# EAGLE design Piksey_Pico_A1 (EAGLE 9.0.1)
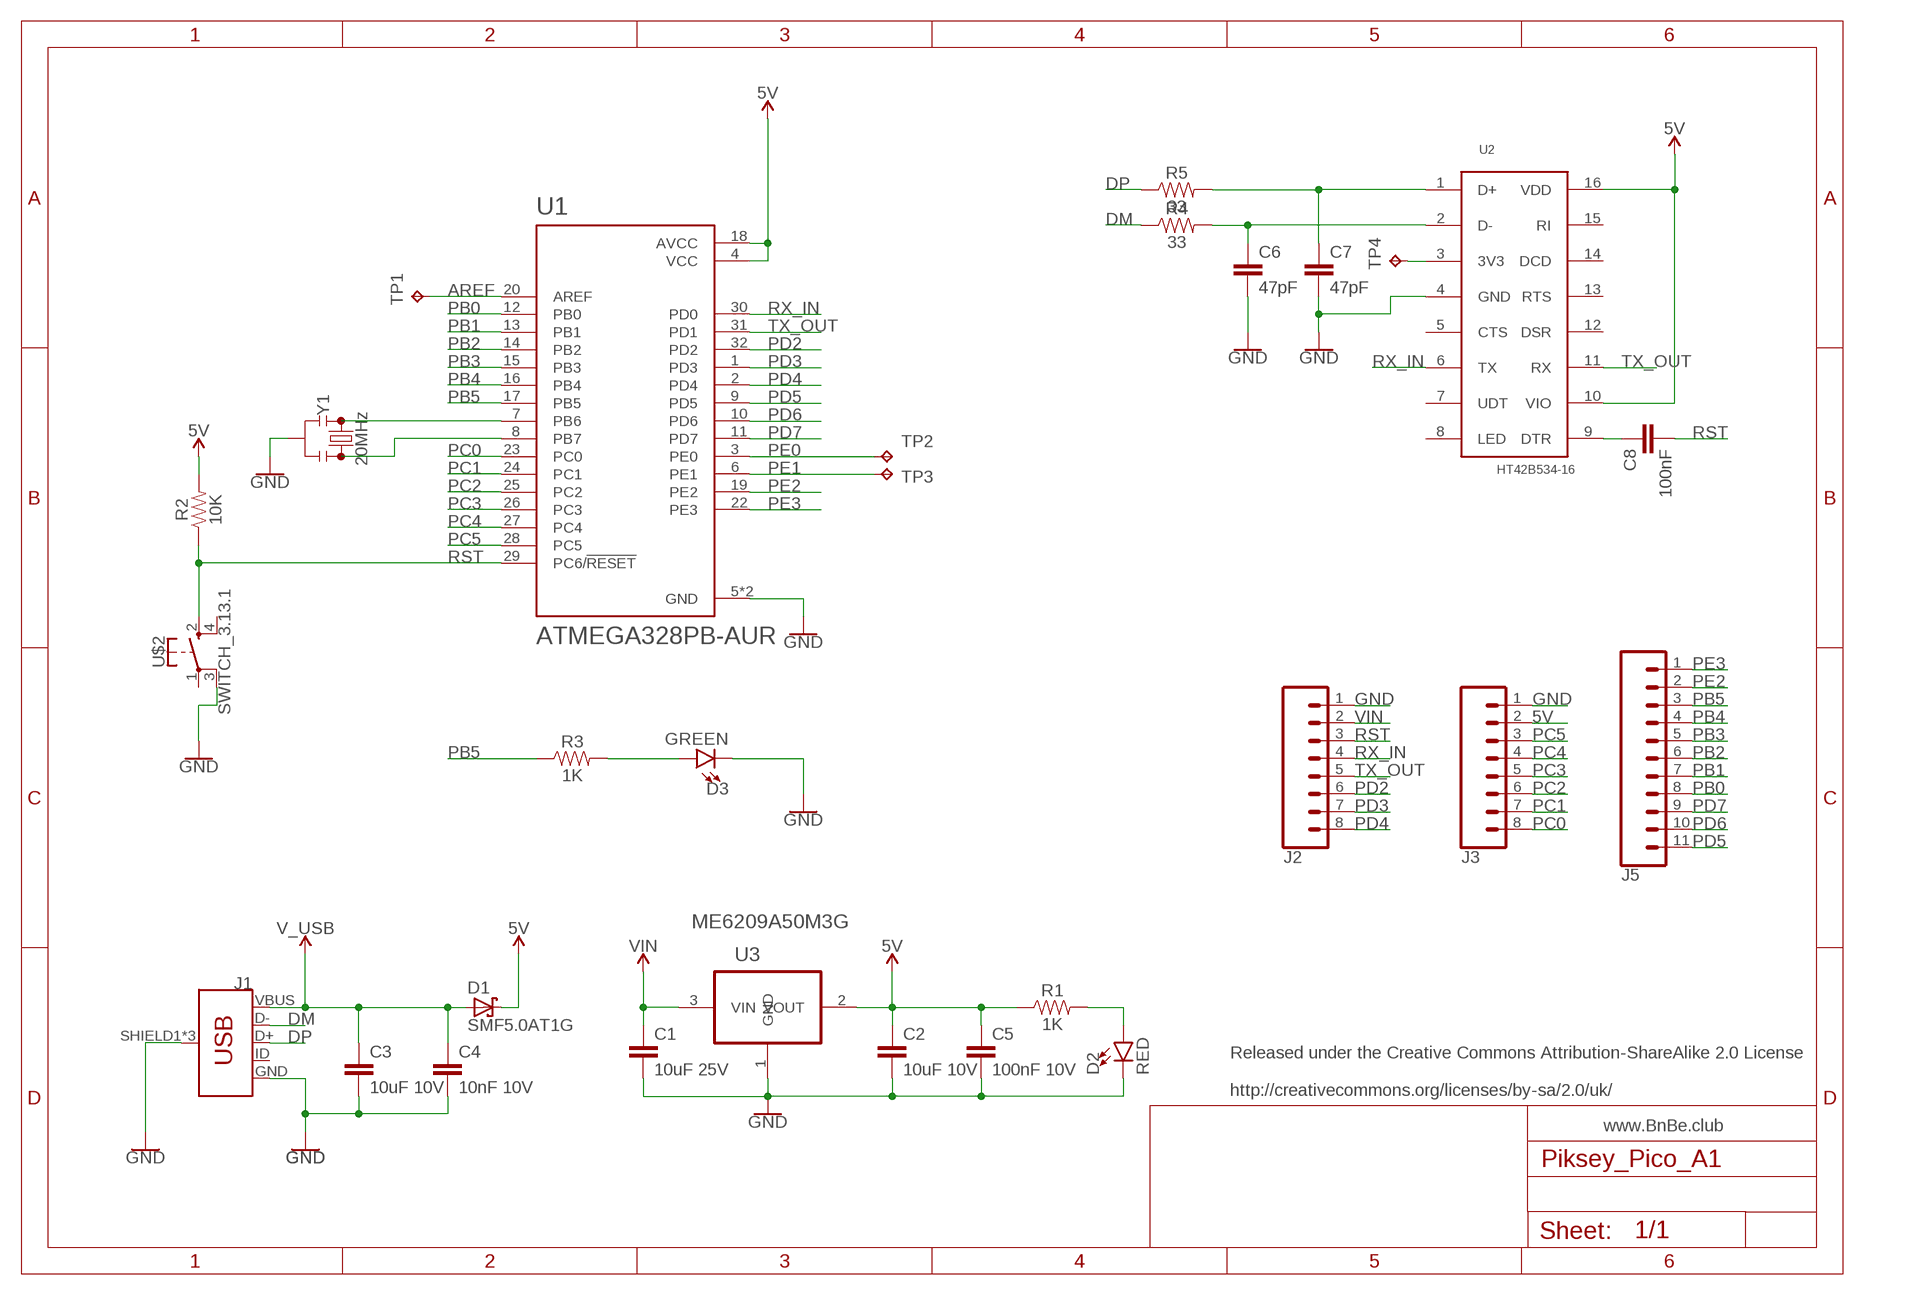
[diagram p0: schematic, sheet 1]

## Parts
C1  10uF 25V  10UF-0603-6.3V-20%  [0603]
C2  10uF 10V  100PF-0402-50V-5%  [0402]
C3  10uF 10V  100PF-0402-50V-5%  [0402]
C4  10nF 10V  100PF-0402-50V-5%  [0402]
C5  100nF 10V  100PF-0402-50V-5%  [0402]
C6  47pF  100PF-0402-50V-5%  [0402]
C7  47pF  100PF-0402-50V-5%  [0402]
C8  100nF  100PF-0402-50V-5%  [0402]
D1  SMF5.0AT1G  [SOD123FL]
D2  RED  LED0603  [LED-0603]
D3  GREEN  LED0603  [LED-0603]
J1  USB_MICRO-B_FEMALE-SMT  [USB-B-MICRO-SMD]
J2  CONN_08NO_SILK_FEMALE_PTH  [1X08_NO_SILK]
J3  CONN_08NO_SILK_FEMALE_PTH  [1X08_NO_SILK]
J5  CONN_11_1.27MM  [1X11-1.27MM]
R1  1K  RESISTOR0402  [0402]
R2  10K  RESISTOR0402  [0402]
R3  1K  RESISTOR0402  [0402]
R4  33  RESISTOR0402  [0402]
R5  33  RESISTOR0402  [0402]
TP1  TPB1,27  [B1,27]
TP2  TPB1,27  [B1,27]
TP3  TPB1,27  [B1,27]
TP4  TPB1,27  [B1,27]
U1  ATMEGA328PB-AUR  [QFP80P900X900X120-32N]
U2  HT42B534-16  [NSOP-16]
U3  ME6209A50M3G  MCP1700T-3302E/TT  [SOT95P237X112-3N]
U$2  SWITCH_3.13.1  [SWITCH_3.1X3.1]
Y1  20MHz  RESONATOR-16MHZSMD_3.2X1.3  [RESONATOR-SMD-3.2X1.3]

## Nets
5V: C2.1 C5.1 D1.C J3.2 R1.1 R2.2 U1.4(VCC) U1.18(AVCC) U2.10(VIO) U2.16(VDD) U3.2(VOUT)
AREF: TP1.TP U1.20(AREF)
DM: J1.D- R4.1
DP: J1.D+ R5.1
GND: C1.2 C2.2 C3.2 C4.2 C5.2 C6.2 C7.2 D2.C D3.C J1.GND J1.SHIELD1(SHIELD) J1.SHIELD2(SHIELD) J1.SHIELD3(SHIELD) J2.1 J3.1 U1.5(GND) U1.21(GND) U2.4(GND) U3.1(GND) U$2.3 Y1.2
N$1: TP4.TP U2.3(3V3)
N$2: C7.1 R5.2 U2.1(D+)
N$3: U1.7(PB6) Y1.1
N$4: C8.1 U2.9(DTR)
N$5: U1.8(PB7) Y1.3
N$6: D2.A R1.2
N$7: C6.1 R4.2 U2.2(D-)
N$9: D3.A R3.2
PB0: J5.8 U1.12(PB0)
PB1: J5.7 U1.13(PB1)
PB2: J5.6 U1.14(PB2)
PB3: J5.5 U1.15(PB3)
PB4: J5.4 U1.16(PB4)
PB5: J5.3 R3.1 U1.17(PB5)
PC0: J3.8 U1.23(PC0)
PC1: J3.7 U1.24(PC1)
PC2: J3.6 U1.25(PC2)
PC3: J3.5 U1.26(PC3)
PC4: J3.4 U1.27(PC4)
PC5: J3.3 U1.28(PC5)
PD2: J2.6 U1.32(PD2)
PD3: J2.7 U1.1(PD3)
PD4: J2.8 U1.2(PD4)
PD5: J5.11 U1.9(PD5)
PD6: J5.10 U1.10(PD6)
PD7: J5.9 U1.11(PD7)
PE0: TP2.TP U1.3(PE0)
PE1: TP3.TP U1.6(PE1)
PE2: J5.2 U1.19(PE2)
PE3: J5.1 U1.22(PE3)
RST: C8.2 J2.3 R2.1 U1.29(PC6/!RESET) U$2.2
RX_IN: J2.4 U1.30(PD0) U2.6(TX)
TX_OUT: J2.5 U1.31(PD1) U2.11(RX)
V_USB: C3.1 C4.1 D1.A J1.VBUS
VIN: C1.1 J2.2 U3.3(VIN)
Unconnected: J1.ID U2.5(CTS) U2.7(UDT) U2.8(LED) U2.12(DSR) U2.13(RTS) U2.14(DCD) U2.15(RI) U$2.1 U$2.4

## Notes on the sheet
- Released under the Creative Commons Attribution-ShareAlike 2.0 License
  
  http://creativecommons.org/licenses/by-sa/2.0/uk/
- www.BnBe.club

## Library data of the parts
C1 = SparkFun-Capacitors:10UF: 10.0µF ceramic capacitors A capacitor is a passive two-terminal electrical component used to store electrical energy temporarily in an electric field.; PROD_ID: CAP-11015; VALUE: 10uF
C2-C8 = SparkFun-Capacitors:100PF: 100pF/0.1nF ceramic capacitors A capacitor is a passive two-terminal electrical component used to store electrical energy temporarily in an electric field.; PROD_ID: CAP-13458; VALUE: 100PF
D1 = SMF5.0AT1G:SMF5.0AT1G: 200 W Transient Voltage Suppressor Source: Data sheet <http://www.onsemi.com/pub_link/Collateral/SMF5.0AT1G-D.PDF>; AVAILABILITY: Warning; DESCRIPTION: Tvs Diode, 200w, 5v, Sod-123fl, Full Reel; MF: Littelfuse; MP: SMF5.0AT1G; PACKAGE: SOD-123 Littelfuse; PRICE: 0.17 USD
D2 D3 = SparkFun-LED:LED: LED (Generic) Standard schematic elements and footprints for 5mm, 3mm, 1206, and 0603 sized LEDs. Generic LEDs with no color specified.
J1 = SparkFun-Connectors:USB_MICRO-B: USB Type Micro-B Connector Male/female and PTH/SMT variants SparkFun Products: SparkFun microB USB Breakout <https://www.sparkfun.com/products/12035> SparkFun USB microB Plug Breakout <https://www.sparkfun.com/products/10031> SparkFun ESP8266 Thing <https://www.sparkfun.com/products/13231>; PROD_ID: CONN-11752
J2 J3 = SparkFun-Connectors:CONN_08: Multi connection point. Often used as Generic Header-pin footprint for 0.1 inch spaced/style header connections On any of the 0.1 inch spaced packages, you can populate with these: Break Away Headers - Straight <https://www.sparkfun.com/products/116> (PRT-00116) Break Away Male Headers - Right Angle <https://www.sparkfun.com/products/553> (PRT-00553) Female Headers <https://www.sparkfun.com/products/115> (PRT-00115) Break Away Headers - Machine Pin <https://www.sparkfun.com/products/117> (PRT-00117) Break Away Female Headers - Swiss Machine Pin <https://www.sparkfun.com/products/743> (PRT-00743) Arduino Stackable Header - 8 Pin <https://www.sparkfun.com/products/9279> (PRT-09279) For SCREWTERMINALS and SPRING TERMINALS visit here: Screw Terimnals on SparkFun.com <https://www.sparkfun.com/search/results?term=Screw+Terminals> (5mm/3.5mm/2.54mm spacing) This device is also useful as a general connection point to wire up your design to another part of your project. Our various solder wires solder well into these plated through hole pads. Hook-Up Wire - Assortment (Stranded, 22 AWG) <https://www.sparkfun.com/products/11375> (PRT-11375) Hook-Up Wire - Assortment (Solid Core, 22 AWG) <https://www.sparkfun.com/products/11367> (PRT-11367) View the entire wire category on our website here <https://www.sparkfun.com/categories/141> Special notes: Molex polarized connector foot print use with SKU : PRT-08231 with associated crimp pins and housings. 1MM SMD Version SKU: PRT-10208 NOTES ON THE VARIANTS LOCK and LOCK_LONGPADS... This footprint was designed to help hold the alignment of a through-hole component (i.e. 6-pin header) while soldering it into place. You may notice that each hole has been shifted either up or down by 0.005 of an inch from it's more standard position (which is a perfectly straight line). This slight alteration caused the pins (the squares in the middle) to touch the edges of the holes. Because they are alternating, it causes a "brace" to hold the component in place. 0.005 has proven to be the perfect amount of "off-center" position when using our standard breakaway headers. Although looks a little odd when you look at the bare footprint, once you have a header in there, the alteration is very hard to notice. Also,if you push a header all the way into place, it is covered up entirely on the bottom side.; PROD_ID: CONN-08438
J5 = SparkFun-Connectors:CONN_11: Multi connection point. Often used as Generic Header-pin footprint for 0.1 inch spaced/style header connections On any of the 0.1 inch spaced packages, you can populate with these: Break Away Headers - Straight <https://www.sparkfun.com/products/116> (PRT-00116) Break Away Male Headers - Right Angle <https://www.sparkfun.com/products/553> (PRT-00553) Female Headers <https://www.sparkfun.com/products/115> (PRT-00115) Break Away Headers - Machine Pin <https://www.sparkfun.com/products/117> (PRT-00117) Break Away Female Headers - Swiss Machine Pin <https://www.sparkfun.com/products/743> (PRT-00743) For SCREWTERMINALS and SPRING TERMINALS visit here: Screw Terimnals on SparkFun.com <https://www.sparkfun.com/search/results?term=Screw+Terminals> (5mm/3.5mm/2.54mm spacing) This device is also useful as a general connection point to wire up your design to another part of your project. Our various solder wires solder well into these plated through hole pads. Hook-Up Wire - Assortment (Stranded, 22 AWG) <https://www.sparkfun.com/products/11375> (PRT-11375) Hook-Up Wire - Assortment (Solid Core, 22 AWG) <https://www.sparkfun.com/products/11367> (PRT-11367) View the entire wire category on our website here <https://www.sparkfun.com/categories/141>
R1-R5 = SparkFun-Resistors:RESISTOR: Generic Resistor Package
TP1-TP4 = testpad:TP: Test pad
U1 = ATMEGA328PB-AUR:ATMEGA328PB-AUR: ATmega Series 20 MHz 32 KB Flash 2 KB SRAM 8-Bit Microcontroller - TQFP-32; AVAILABILITY: Good; DESCRIPTION: AVR microcontroller; EEPROM: 1024B; SRAM: 2kB; Flash: 32kB; TQFP32; MF: Microchip; MP: ATMEGA328PB-AUR; PACKAGE: TQFP-32 Microchip; PRICE: 1.36 USD
U2 = Frenoy_Custom:HT42B534-16
U3 = MCP1700T-3302E_TT:MCP1700T-3302E/TT: Low Quiescent Current LDO; AVAILABILITY: Good; DESCRIPTION: MCP1700 Series 250 mA 3.3 V Fixed Output LDO Voltage Regulator - SOT-23; MF: Microchip; MP: MCP1700T-3302E/TT; PACKAGE: SOT-23-3 Microchip; PRICE: 0.35 USD
U$2 = Frenoy_Custom:SWITCH_3.1*3.1
Y1 = SparkFun-Clocks:RESONATOR-16MHZ: 16MHz Resonator Digikey Example <http://www.digikey.com/product-detail/en/murata-electronics-north-america/CSTCE16M0V53-R0/490-1198-1-ND/584635> Frequency: 16MHz Frequency Stability: ±0.3% Frequency Tolerance: ±0.5% Capacitance: 15pF SparkFun Products SparkFun OpenLog <https://www.sparkfun.com/products/13712> SparkFun MicroView - OLED Arduino Module <https://www.sparkfun.com/products/12923>; PROD_ID: XTAL-08900; VALUE: 16MHz

## Board
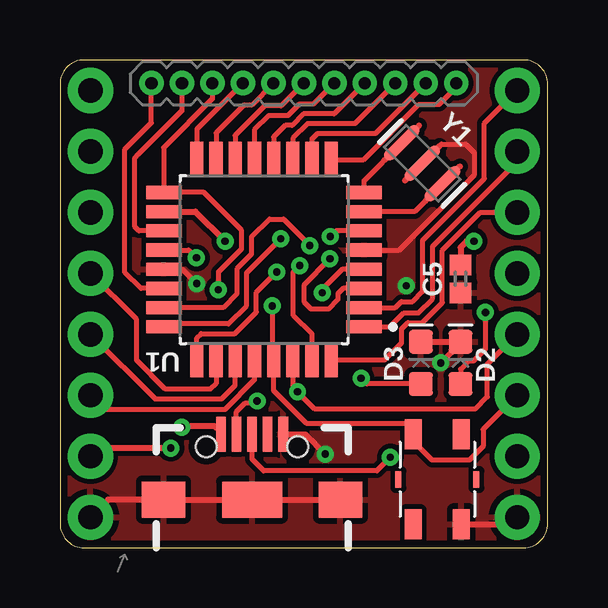
[diagram p1: board, top side]
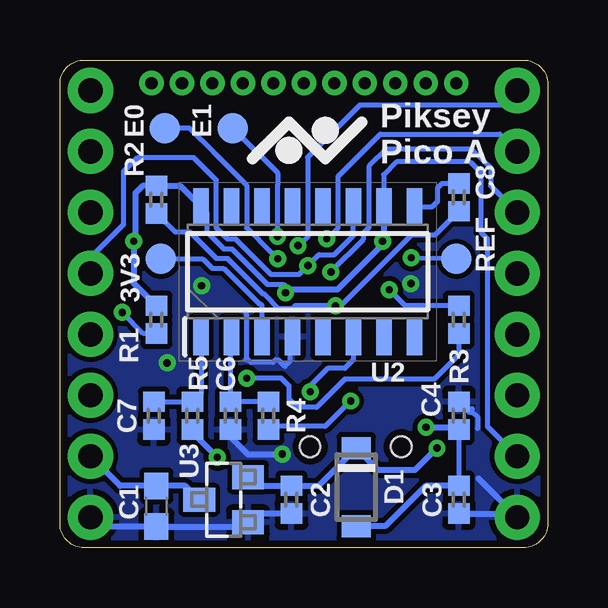
[diagram p2: board, bottom side, seen from below]

Size 20.32 x 20.32 mm. Coordinates in mm from the lower left corner, seen from the top.
Outline: 20.32,1 20.32,19.32 arc90 19.32,20.32 1,20.32 arc90 0,19.32 0,1 arc90 1,0 19.32,0 arc90 20.32,1
Copper layers (1*16): Top 0.035mm / dielectric 1.5mm / Bottom 0.035mm
Design rules "JLPCB_2L_Recommended_Use_this": minimum track width 8mil, minimum drill 0.3mm, track to track 8mil, track to pad 8mil, pad to pad 8mil, via to via 8mil, smd to smd 8mil, copper to edge 12mil, drill to drill 6mil, minimum pad ring 10mil, minimum via ring 8mil, stop-mask expansion 4mil, vias tented up to drill 20mil, thermal gap 10mil

### Footprints (pad centres in the part's own frame; a part is rotated, then mirrored left to right if it is on the bottom)
0603 = smd 1.1 x 1: 1 -0.85,0; 2 0.85,0
0402 = smd 0.85 x 0.9: 1 -0.58,0; 2 0.58,0
SOD123FL = smd 0.91 x 1.22: A 1.625,0; C -1.625,0
LED-0603 = smd 1 x 1: A -0.877,0; C 0.877,0
USB-B-MICRO-SMD = smd 1.45 x 0.4: D+ 2.725,0; D- 2.725,0.65; GND 2.725,-1.3; ID 2.725,-0.65; VBUS 2.725,1.3 | smd 1.5 x 1.8: SHIELD1 0,3.685; SHIELD2 0,-3.685 | smd 1.5 x 2.5: SHIELD3 0,0 | hole 0.85: 2.2,1.9; 2.2,-1.9
1X08_NO_SILK = drill 1.016 pad 1.88: 1 0,0; 2 2.54,0; 3 5.08,0; 4 7.62,0; 5 10.16,0; 6 12.7,0; 7 15.24,0; 8 17.78,0
1X11-1.27MM = drill 0.508 pad 1: 1 0,0; 2 1.27,0; 3 2.54,0; 4 3.81,0; 5 5.08,0; 6 6.35,0; 7 7.62,0; 8 8.89,0; 9 10.16,0; 10 11.43,0; 11 12.7,0
B1,27 = smd 1.27 x 1.27: TP 0,0
QFP80P900X900X120-32N = smd 1.47 x 0.55: 1 -4.17,2.8; 2 -4.17,2; 3 -4.17,1.2; 4 -4.17,0.4; 5 -4.17,-0.4; 6 -4.17,-1.2; 7 -4.17,-2; 8 -4.17,-2.8; 17 4.17,-2.8; 18 4.17,-2; 19 4.17,-1.2; 20 4.17,-0.4; 21 4.17,0.4; 22 4.17,1.2; 23 4.17,2; 24 4.17,2.8 | smd 0.55 x 1.47: 9 -2.8,-4.17; 10 -2,-4.17; 11 -1.2,-4.17; 12 -0.4,-4.17; 13 0.4,-4.17; 14 1.2,-4.17; 15 2,-4.17; 16 2.8,-4.17; 25 2.8,4.17; 26 2,4.17; 27 1.2,4.17; 28 0.4,4.17; 29 -0.4,4.17; 30 -1.2,4.17; 31 -2,4.17; 32 -2.8,4.17
NSOP-16 = smd 1.525 x 0.65: 1 -2.712,4.445; 2 -2.712,3.175; 3 -2.712,1.905; 4 -2.712,0.635; 5 -2.712,-0.635; 6 -2.712,-1.905; 7 -2.712,-3.175; 8 -2.712,-4.445; 9 2.712,-4.445; 10 2.712,-3.175; 11 2.712,-1.905; 12 2.712,-0.635; 13 2.712,0.635; 14 2.712,1.905; 15 2.712,3.175; 16 2.712,4.445
SOT95P237X112-3N = smd 0.991 x 1.321: 1 -0.94,-1.016; 2 0.94,-1.016; 3 0,1.016
SWITCH_3.1X3.1 = smd 1.25 x 0.7: 1 -1.875,1; 2 -1.875,-1; 3 1.875,1; 4 1.875,-1 | smd 0.7 x 0.25: P$5 0,1.625; P$6 0,-1.625
RESONATOR-SMD-3.2X1.3 = smd 0.45 x 1.905: 1 -1.2,0; 2 0,0; 3 1.2,0

### Placement (x,y rotation side)
C1  16.3,1.73 270 bottom
C2  10.68,2 270 bottom
C3  3.7,2 270 bottom
C4  3.7,5.5 90 bottom
C5  16.69,11.2 270 top
C6  13.21,5.5 270 bottom
C7  16.41,5.5 270 bottom
C8  3.7,14.6 270 bottom
D1  7.98,2.52 270 bottom
D2  16.69,7.7 90 top
D3  15.04,7.7 90 top
J1  8,2 90 top
J2  19.05,1.27 90 top
J3  1.27,1.27 90 top
J5  3.81,19.35 0 top
R1  16.3,9.5 270 bottom
R2  16.3,14.5 90 bottom
R3  3.7,9.5 270 bottom
R4  11.63,5.5 90 bottom
R5  14.8,5.5 90 bottom
TP1  3.8,12.03 0 bottom
TP2  15.95,17.48 0 bottom
TP3  13.13,17.48 0 bottom
TP4  16.12,12.03 0 bottom
U1  8.5,12 180 top
U2  10,11.5 90 bottom
U3  13.5,2 90 bottom
U$2  15.72,2.84 270 top
Y1  15.09,16.02 135 top

### Tracks (layer width: path | path; a pad name or v marks a point on that pad's centre or on a via)
5V  (via drill 0.3)
  Top 0.203: U1.4 11.75,11.6 10.93,10.78 v10.93,10.62
  Top 0.254: v4.61,4.15 1.61,4.15 J3.2 | v17.25,12.77 16.95,12.77 16.69,12.51 C5.1 | C5.1 | U1.18 5.64,14 v6.88,12.76
  Bottom 0.203: 6.83,13.64 U2.10 6.83,15.54 6.83,15.55 6.3,16.08 3.23,16.08 2.79,15.63 2.79,13.15 2.52,12.88 2.52,5.05 J3.2 | R1.1 | U2.16 14.21,13.98 14.21,13.15 13.5,12.45 13.16,12.45 11.69,10.97 11.01,10.97 10.79,10.76
  Bottom 0.254: U3.2 12.12,2.58 C2.1 9.54,2.58 D1.C | 7.98,4 D1.C | v4.61,4.15 5.52,3.24 7.07,3.24 D1.C | U2.16 15.31,15.08 R2.2 16.88,15.08 17.18,14.77 17.18,12.83 v17.25,12.77 17.25,11.03 R1.1 | U2.10 6.83,12.82 v6.88,12.76 6.88,12.64 8.76,10.76 10.79,10.76 v10.93,10.62
AREF  (via drill 0.3)
  Top 0.203: U1.20 5.36,12.4 v5.68,12.07
  Bottom 0.203: v5.68,12.07 3.64,12.07 TP1.TP
DM  (via drill 0.3)
  Top 0.203: J1.D- 7.35,5.66 7.72,6.04 8.13,6.04 v8.21,6.11
  Bottom 0.203: v8.21,6.11 9.27,5.05 11.5,5.05 R4.1
DP  (via drill 0.3)
  Top 0.203: v13.77,3.77 13.2,3.21 8.48,3.21 8,3.69 J1.D+
  Bottom 0.254: R5.1 14.8,4.8 v13.77,3.77
GND  (via drill 0.3)
  Top 0.203: Y1.2 15.89,16.82 16.9,16.82 17.27,16.44 17.27,15.54 14.13,12.4 U1.5 | U1.21 5.1,11.6 v5.7,11.01
  Top 0.254: J1.SHIELD2 J1.SHIELD3 J1.SHIELD1 2,2 J3.1 | U$2.3 18.75,0.97 J2.1 | D3.C D2.C 16.69,8.53 v15.86,7.7 | J1.GND 10.23,4.72 v11.05,3.9
  Bottom 0.203: 3.85,1.42 C3.2 | C4.2 3.27,5.65 3.12,5.65 2.92,5.45 2.92,4.96 | U2.4 10.76,8.67 10.76,7.75 10.95,7.55 11.21,7.82 11.35,7.82 11.45,7.72 12.36,7.72 12.46,7.82 12.55,7.82 12.55,7.89 12.54,7.9 12.54,9.72 12.57,9.75
  Bottom 0.254: C2.2 12.12,1.42 U3.1 12.67,0.88 C1.2 18.66,0.88 J2.1 | 2.87,2.87 J3.1 1.42,1.42 C3.2 | C4.2 3.4,5.78 3.15,5.78 | C6.2 13.21,4.61 12.49,3.89 11.06,3.89 v11.05,3.9
  other vias: 14.42,10.91
  pour Top (isolate 0.203): -0.2,20.6 20.4,20.6 20.4,-0.2 -0.4,-0.2 -0.4,20.4
  pour Bottom (isolate 0.203): -0.4,20.6 20.45,20.6 20.45,-0.2 -1.1,-0.2 -0.92,20.67
N$1
  Bottom 0.203: TP4.TP 14.37,12.03 13.98,11.63 13.5,11.63 12.03,10.16 11.97,10.16 11.9,10.1 U2.3
N$2
  Bottom 0.203: C7.1 R5.2 | R5.2 | U2.1 14.45,6.45 R5.2
N$3
  Top 0.203: Y1.1 16.03,15.44 | Y1.1 | Y1.1 14.77,14 U1.7
N$4
  Bottom 0.203: U2.9 4.8,14.21 4.58,14.43 4.58,14.82 4.58,14.99 4.4,15.18 C8.1
N$5
  Top 0.203: U1.8 12.67,15.29 Y1.3
N$6  (via drill 0.3)
  Top 0.203: 16.69,6.99 D2.A 16.69,7.44 17.02,7.77 17.23,7.77 17.73,8.27 v17.73,9.8
  Bottom 0.203: R1.2 16.85,8.92 v17.73,9.8
N$7
  Bottom 0.203: R4.2 C6.1 | 13.18,6.11 C6.1 | 13.18,8.22 U2.2 13.21,8.76 C6.1
N$9  (via drill 0.3)
  Top 0.203: D3.A 12.78,6.82 v12.54,7.06
  Bottom 0.203: R3.2 3.7,8.04 4.72,7.02 8.45,7.02 9.62,5.84 10.44,5.84 10.77,6.18 10.77,6.73 11.1,7.06 v12.54,7.06
PB0
  Top 0.203: U1.12 8.9,17.11 9.39,17.6 9.67,17.6 10.14,18.07 11.42,18.07 J5.8
PB1
  Top 0.203: J5.7 10.56,18.48 9.97,18.48 9.5,18.01 8.7,18.01 8.1,17.41 U1.13
PB2
  Top 0.203: J5.6 9.22,18.41 8.53,18.41 7.3,17.18 U1.14
PB3
  Top 0.203: J5.5 7.98,18.45 7.66,18.45 6.5,17.29 U1.15
PB4
  Top 0.203: J5.4 5.7,17.43 U1.16
PB5  (via drill 0.3)
  Top 0.203: J5.3 6.35,18.7 4.32,16.67 U1.17 5.99,14.8 7.57,13.22 7.57,12.45 6.59,11.48 v6.59,10.74
  Bottom 0.203: R3.1 5.93,10.08 v6.59,10.74
PC0  (via drill 0.3)
  Top 0.203: v10.4,12.59 10.4,12.61 9.31,13.7 8.73,13.7 7.98,12.94 7.98,12.23 7.37,11.62 7.37,10.58 6.79,10.01 U1.23
  Bottom 0.203: v10.4,12.59 10.01,12.93 10.01,16.27 7.82,18.45 1.86,18.45 J3.8
PC1  (via drill 0.3)
  Top 0.203: U1.24 4.46,9.33 7.02,9.33 7.78,10.09 7.78,11.45 v9.2,12.88
  Bottom 0.203: v9.2,12.88 9.18,12.88 8.73,13.32 8.73,15.47 6.97,17.23 1.99,17.23 J3.7
PC2  (via drill 0.3)
  Top 0.203: U1.25 5.7,8.74 5.88,8.92 7.29,8.92 8.18,9.82 8.18,10.64 v9.03,11.49
  Bottom 0.203: J3.6 2.38,15.08 2.38,15.84 2.44,15.89 2.44,15.91 2.56,16.01 3.17,16.63 6.71,16.63 7.46,15.89 7.46,13.33 7.69,13.1 7.69,12.84 v9.03,11.49
PC3
  Top 0.203: U1.26 6.5,6.84 6.27,6.61 4.39,6.61 3.19,7.81 3.19,9.51 J3.5
PC4
  Top 0.203: J3.4 3.96,6.2 6.74,6.2 7.3,6.76 U1.27
PC5
  Top 0.203: U1.28 8.1,6.99 6.87,5.75 1.86,5.75 J3.3
PD2
  Top 0.203: U1.32 13.53,7.83 14.23,8.54 14.23,9.12 14.5,9.38 15.1,9.38 15.93,10.21 15.93,12.39 17.52,13.97 J2.6
PD3
  Top 0.203: U1.1 13.74,9.2 14.33,9.79 14.93,9.79 15.53,10.38 15.53,12.55 19.05,16.08 J2.7
PD4
  Top 0.203: J2.8 17.68,17.68 17.68,15.38 15.12,12.82 15.12,10.68 14.7,10.25 14.22,10.25 13.97,10 U1.2 12.69,10.02
PD5
  Top 0.203: U1.9 12.65,16.17 14.96,18.47 15.79,18.47 16.51,19.19 J5.11
PD6
  Top 0.203: U1.10 10.49,17.02 10.73,17.26 13.15,17.26 J5.10
PD7
  Top 0.203: U1.11 9.7,17.05 10.32,17.67 12.28,17.67 J5.9
PE0  (via drill 0.3)
  Top 0.203: U1.3 11.79,10.8 11.58,10.59 11.58,10.35 11.18,9.95 10.46,9.95 10.18,10.23 10.18,10.96 v11.25,12.04
  Bottom 0.203: 13.89,16.45 12.54,15.1 12.54,13.32 11.53,12.31 11.52,12.31 v11.25,12.04 | 13.89,16.45 13.9,16.45 | 13.89,16.45 14.93,17.48 TP2.TP
PE1  (via drill 0.3)
  Top 0.203: U1.6 11.49,13.2 v11.26,12.96
  Bottom 0.203: v11.26,12.96 11.26,13.26 11.26,13.32 11.27,13.32 11.27,15.1 11.26,15.11 11.26,15.61 TP3.TP
PE2
  Top 0.203: J5.2 5.08,18.2 3.31,16.43 3.29,16.41 3.12,16.23 3.12,13.37 3.29,13.2 U1.19
PE3
  Top 0.203: U1.22 3.37,10.8 2.7,11.46 2.7,16.59 3.81,17.7 J5.1
RST  (via drill 0.3)
  Top 0.203: J2.3 17.63,4.93 17.63,4.22 17.06,3.65 15.51,3.65 14.72,4.43 U$2.2 14.72,5.21 14.7,5.24 14.64,5.19 10.26,5.19 8.9,6.54 8.9,8 8.84,8.05 | U1.29 8.84,7.89 8.84,8.05 | v8.84,10.07 8.84,8.05
  Bottom 0.203: C8.2 4.7,13.02 5.68,13.02 8.63,10.07 v8.84,10.07 | 8.95,9.95 v8.84,10.07 | 8.95,9.96 v8.84,10.07 | v8.84,10.07 10.54,10.07 10.65,9.96 11.2,9.96 11.8,10.56 11.86,10.56 13.33,12.04 13.79,12.04 14.9,13.14 15.53,13.14 R2.1
RX_IN  (via drill 0.3)
  Top 0.203: U1.30 9.7,6.7 v9.89,6.5 10.62,5.78 17.29,5.78 17.8,6.29 17.8,7.64 J2.4
  Bottom 0.203: U2.6 8.1,7.83 8.46,7.47 9.16,7.47 9.89,6.74 v9.89,6.5
TX_OUT  (via drill 0.3)
  Top 0.203: 10.5,7.2 U1.31 10.5,8.89 9.72,9.67 9.72,11.49 v9.99,11.76
  Bottom 0.203: J2.5 19.05,12.09 17.68,13.46 17.68,15.66 17.07,16.27 14.76,16.27 13.8,15.31 13.8,13.32 13.33,12.85 12.99,12.85 11.52,11.38 10.37,11.38 v9.99,11.76 9.54,12.21 8.89,12.21 8.09,13.01 U2.11
V_USB  (via drill 0.3)
  Top 0.254: 6.74,4.77 6.7,4.81 | v5.07,5.02 5.1,5.06 6.46,5.06 6.65,4.87 6.7,4.81 | J1.VBUS 6.7,4.81
  Bottom 0.203: C4.1 C3.1
  Bottom 0.254: v5.07,5.02 3.8,5.02 C4.1 | C3.1 5.09,2.58 6.77,0.9 D1.A
VIN
  Bottom 0.254: J2.2 17.82,2.58 C1.1 15.09,2.58 U3.3

### Text on the board
bPlace: Piksey | Pico A
bNames: E1 | E0 | REF | 3V3